# EAGLE design GO-RGO BOARD 26-09-22 final update 7PM (EAGLE 9.6.2)
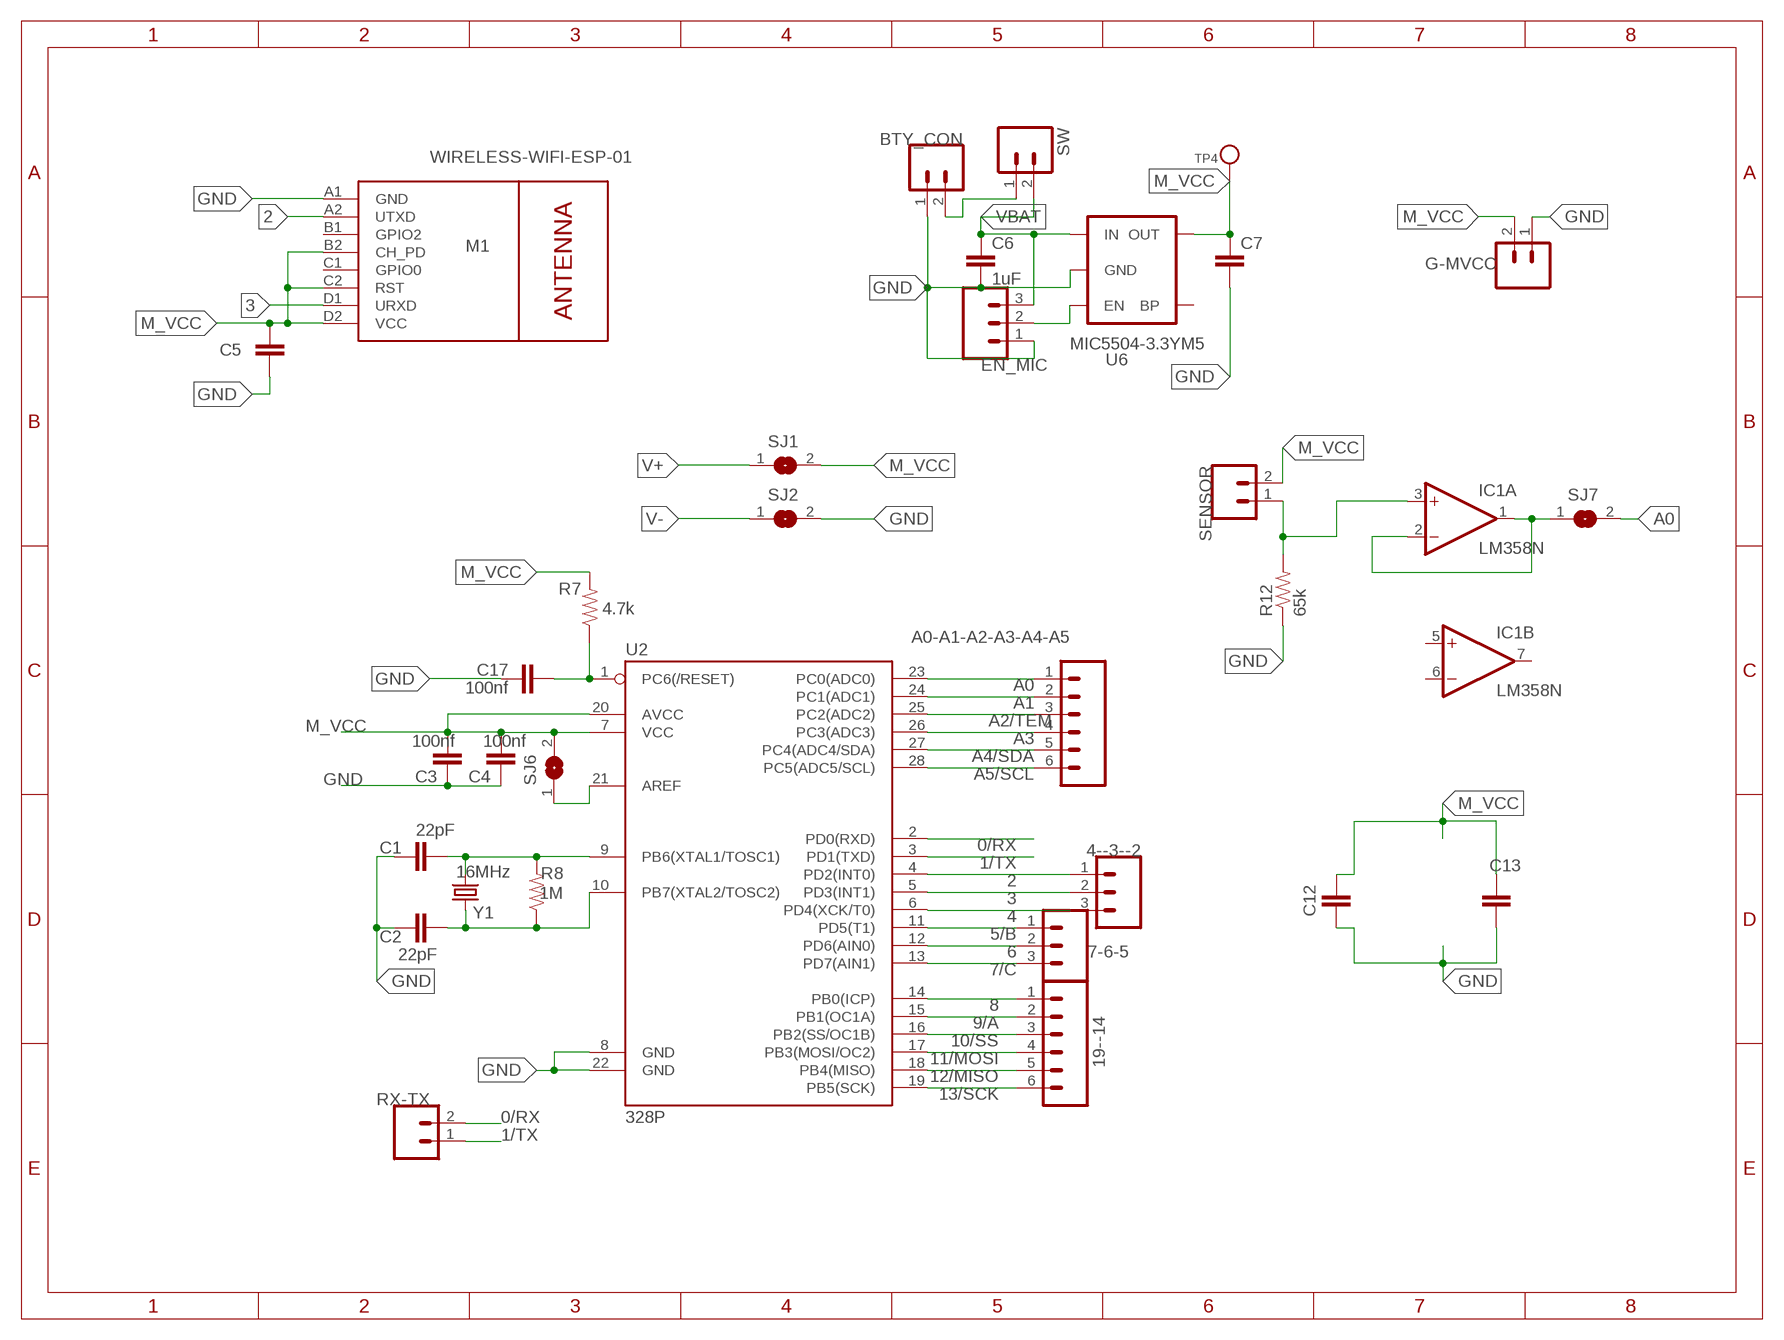
[diagram p0: schematic, sheet 1]

## Parts
4--3--2  M03PTH  [1X03]
7-6-5  M03PTH  [1X03]
19--14  M06SIP  [1X06]
A0-A1-A2-A3-A4-A5  M06SIP  [1X06]
BTY_CON  M02PTH  [1X02]
C1  22pF  CAP0805  [0805]
C2  22pF  CAP0805  [0805]
C3  100nf  CAP0805  [0805]
C4  100nf  CAP0805  [0805]
C5  100nf  CAP0805  [0805]
C6  1uF  CAP0805  [0805]
C7  1uF  CAP0805  [0805]
C12  100nf  CAP0805  [0805]
C13  100nf  CAP0805  [0805]
C17  100nf  CAP0805  [0805]
EN_MIC  M03PTH  [1X03]
G-MVCC  M02PTH  [1X02]
IC1  LM358N  [DIL08]
M1  WIRELESS-WIFI-ESP-01  [WIRELESS-WIFI-ESP-01]
R7  4.7k  RESISTOR0805-RES  [0805]
R8  1M  RESISTOR0805-RES  [0805]
R12  65k  RESISTOR0805-RES  [0805]
RX-TX  M02PTH  [1X02]
SENSOR  M02PTH  [1X02]
SJ1  SJ  [SJ]
SJ2  SJ  [SJ]
SJ6  SJ  [SJ]
SJ7  SJ  [SJ]
SW  M02PTH  [1X02]
TP4  TESTPOINTROUND1MM  [TESTPOINT_ROUND_1MM]
U2  328P  ATMEGA328P_PDIP  [DIP28]
U6  MIC5504-3.3YM5  V_REG_LDOSMD  [SOT23-5]
Y1  16MHz  CRYSTAL-16MHZPTH-HC49US  [HC49US]

## Nets
0/RX: RX-TX.2 U2.2(PD0(RXD))
1/TX: RX-TX.1 U2.3(PD1(TXD))
2: 4--3--2.1 M1.A2(UTXD) U2.4(PD2(INT0))
3: 4--3--2.2 M1.D1(URXD) U2.5(PD3(INT1))
4: 4--3--2.3 U2.6(PD4(XCK/T0))
5/B: 7-6-5.1 U2.11(PD5(T1))
6: 7-6-5.2 U2.12(PD6(AIN0))
7/C: 7-6-5.3 U2.13(PD7(AIN1))
8: 19--14.1 U2.14(PB0(ICP))
9/A: 19--14.2 U2.15(PB1(OC1A))
10/SS: 19--14.3 U2.16(PB2(SS/OC1B))
11/MOSI: 19--14.4 U2.17(PB3(MOSI/OC2))
12/MISO: 19--14.5 U2.18(PB4(MISO))
13/SCK: 19--14.6 U2.19(PB5(SCK))
A0: A0-A1-A2-A3-A4-A5.1 SJ7.2 U2.23(PC0(ADC0))
A1: A0-A1-A2-A3-A4-A5.2 U2.24(PC1(ADC1))
A2/TEM: A0-A1-A2-A3-A4-A5.3 U2.25(PC2(ADC2))
A3: A0-A1-A2-A3-A4-A5.4 U2.26(PC3(ADC3))
A4/SDA: A0-A1-A2-A3-A4-A5.5 U2.27(PC4(ADC4/SDA))
A5/SCL: A0-A1-A2-A3-A4-A5.6 U2.28(PC5(ADC5/SCL))
GND: BTY_CON.1 C1.1 C2.1 C3.1 C4.1 C5.1 C6.2 C7.2 C12.1 C13.1 C17.1 EN_MIC.1 G-MVCC.1 M1.A1(GND) R12.1 SJ2.2 U2.8(GND) U2.22(GND) U6.2(GND)
M_VCC: C3.2 C4.2 C5.2 C7.1 C12.2 C13.2 G-MVCC.2 M1.B2(CH_PD) M1.C2(RST) M1.D2(VCC) R7.2 SENSOR.2 SJ1.2 SJ6.2 TP4.P$1 U2.7(VCC) U2.20(AVCC) U6.5(OUT)
N$1: BTY_CON.2 SW.1
N$2: IC1.3(A:+IN) R12.2 SENSOR.1
N$9: EN_MIC.2 U6.3(EN)
N$12: C17.2 R7.1 U2.1(PC6(/RESET))
N$14: SJ6.1 U2.21(AREF)
N$19: IC1.1(A:OUT) IC1.2(A:-IN) SJ7.1
N$28: C1.2 R8.2 U2.9(PB6(XTAL1/TOSC1)) Y1.2
N$29: C2.2 R8.1 U2.10(PB7(XTAL2/TOSC2)) Y1.1
V+: SJ1.1
V-: SJ2.1
VBAT: C6.1 EN_MIC.3 SW.2 U6.1(IN)
Unconnected: IC1.5(B:+IN) IC1.6(B:-IN) IC1.7(B:OUT) M1.B1(GPIO2) M1.C1(GPIO0) U6.4(BP)

## Power pins joined to a net without a drawn wire
V+: IC1.8(P:V+)
V-: IC1.4(P:V-)

## Library data of the parts
4--3--2 = SparkFun:M03: Header 3 Standard 3-pin 0.1" header. Use with straight break away headers (SKU : PRT-00116), right angle break away headers (PRT-00553), swiss pins (PRT-00743), machine pins (PRT-00117), and female headers (PRT-00115). Molex polarized connector foot print use with SKU : PRT-08232 with associated crimp pins and housings.
7-6-5 = SparkFun-Connectors1:M03: Header 3 Standard 3-pin 0.1" header. Use with straight break away headers (SKU : PRT-00116), right angle break away headers (PRT-00553), swiss pins (PRT-00743), machine pins (PRT-00117), and female headers (PRT-00115). Molex polarized connector foot print use with SKU : PRT-08232 with associated crimp pins and housings.
19--14 A0-A1-A2-A3-A4-A5 = SparkFun:M06: Header 6 Standard 6-pin 0.1" header. Use with straight break away headers (SKU : PRT-00116), right angle break away headers (PRT-00553), swiss pins (PRT-00743), machine pins (PRT-00117), and female headers (PRT-00115). Molex polarized connector foot print use with SKU : PRT-08094 with associated crimp pins and housings. NOTES ON THE VARIANTS LOCK and LOCK_LONGPADS... This footprint was designed to help hold the alignment of a through-hole component (i.e. 6-pin header) while soldering it into place. You may notice that each hole has been shifted either up or down by 0.005 of an inch from it's more standard position (which is a perfectly straight line). This slight alteration caused the pins (the squares in the middle) to touch the edges of the holes. Because they are alternating, it causes a "brace" to hold the component in place. 0.005 has proven to be the perfect amount of "off-center" position when using our standard breakaway headers. Although looks a little odd when you look at the bare footprint, once you have a header in there, the alteration is very hard to notice. Also, if you push a header all the way into place, it is covered up entirely on the bottom side. This idea of altering the position of holes to aid alignment will be further integrated into the Sparkfun Library for other footprints. It can help hold any component with 3 or more connection pins.
BTY_CON G-MVCC RX-TX SENSOR = SparkFun-3-2-07:M02: Header 2
C1-C5 C17 = SparkFun-Capacitors:CAP: Capacitor Standard 0603 ceramic capacitor, and 0.1" leaded capacitor.
C6 C7 C12 C13 = SparkFun-Passives1:CAP: Capacitor Standard 0603 ceramic capacitor, and 0.1" leaded capacitor.
EN_MIC = SparkFun-3-2-07:M03: Header 3 Standard 3-pin 0.1" header. Use with straight break away headers (SKU : PType-HD), right angle break away headers (PType-HD-RightAngle), swiss pins (PType-30F), machine pins (PType-MP), and female headers (PType-FH). Molex polarized connector foot print use with SKU : Con-Hdr with associated crimp pins and housings.
IC1 = linear:LM358: OP AMP also LM158; LM258; LM2904 Source: http://cache.national.com/ds/LM/LM158.pdf
M1 = diy-modules:WIRELESS-WIFI-ESP-01: Wireless Wi-Fi ESP-01 Module based on ESP8266 chip Click here to find device on ebay.com <http://www.ebay.com/sch/esp8266+esp+01+transceiver>
R7 R8 R12 = SparkFun-Passives:RESISTOR: Resistor Basic schematic elements and footprints for 0603, 1206, and PTH resistors.
SJ1 SJ2 SJ6 SJ7 = jumper:SJ: SMD solder JUMPER
SW = SparkFun:M02: Header 2
TP4 = microbuilder:TESTPOINT: Test Point Various test points for characterisation and PCB testing TESTPOINT_SMT - Compact Surface Mount Test Point [Digikey: 5016KTR-ND]
U2 = SparkFun-IC-Microcontroller:ATMEGA328P_PDIP: Atmel 328P Through hole ATMEGA328P uC used in the Arduino 32kb flash, 1k EEPROM, 2k SRAM Datasheet <http://www.sparkfun.com/datasheets/Components/SMD/ATMega328.pdf> SparkFun Products Storefront component: AVR 28 Pin 20MHz 32K 6A/D - ATMega328P <https://www.sparkfun.com/products/9061> (COM-09061) SparkFun Simon Says - Through-Hole Soldering Kit <https://www.sparkfun.com/products/10547> (KIT-10547) SparkFun Learn to Solder - Simon Says <https://www.sparkfun.com/products/13708> (KIT-13708) SparkFun BigTime Watch Kit <https://www.sparkfun.com/products/11734> (KIT-11734) SparkFun ClockIt <https://www.sparkfun.com/products/10930> (KIT-10930) SparkFun Serial Enabled LCD Kit <https://www.sparkfun.com/products/10097> (LCD-10097) SparkFun Simon Tilts - Through Hole Soldering Kit <https://www.sparkfun.com/products/12634> (KIT-12634) SparkFun Frequency Counter Kit <https://www.sparkfun.com/products/10140> (KIT-10140) FabFM Radio Kit <https://www.sparkfun.com/products/11043> (KIT-11043) SparkFun Binary Blaster Kit <https://www.sparkfun.com/products/12037> (KIT-12037) SparkFun Metro-Gnome <https://www.sparkfun.com/products/9236> (KIT-09236) ATmega328 with Arduino Optiboot (Uno) <https://www.sparkfun.com/products/10524> (DEV-10524); PROD_ID: IC-09136
U6 = SparkFun:V_REG_LDO: Voltage Regulator LDO Standard 150mA LDO voltage regulator in SOT-23 layout. Micrel part MIC5205. BP (by-pass) pin is used to lower output noise with 470pF cap.
Y1 = SparkFun-Clocks:CRYSTAL-16MHZ: 16MHz Crystal Digikey Example <http://www.digikey.com/product-search/en?keywords=535-9122-1-ND> Frequency: 16MHz Frequency Stability: ±50ppm Frequency Tolerance: ±20ppm Load Capacitance: 18pF SparkFun Products: Pro Micro -5V/16MHz <https://www.sparkfun.com/products/12640> SparkFun Serial Enabled LCD Kit <https://www.sparkfun.com/products/10097>; PROD_ID: XTAL-08181; SF_ID: COM-00536

## Board
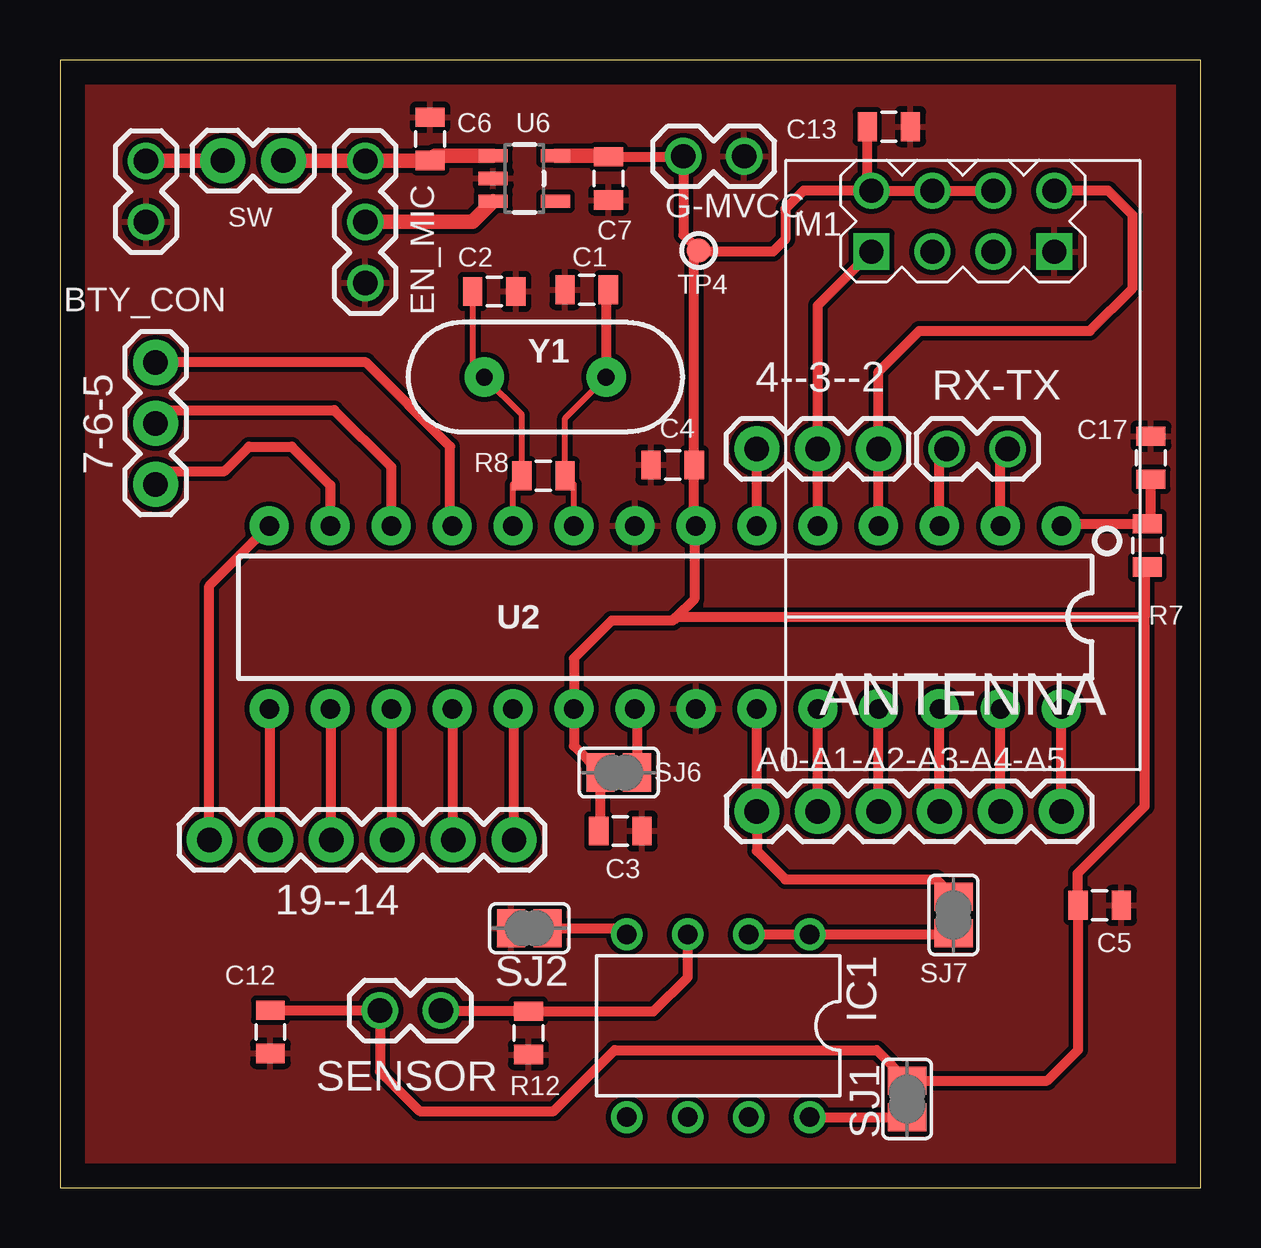
[diagram p1: board, top side]
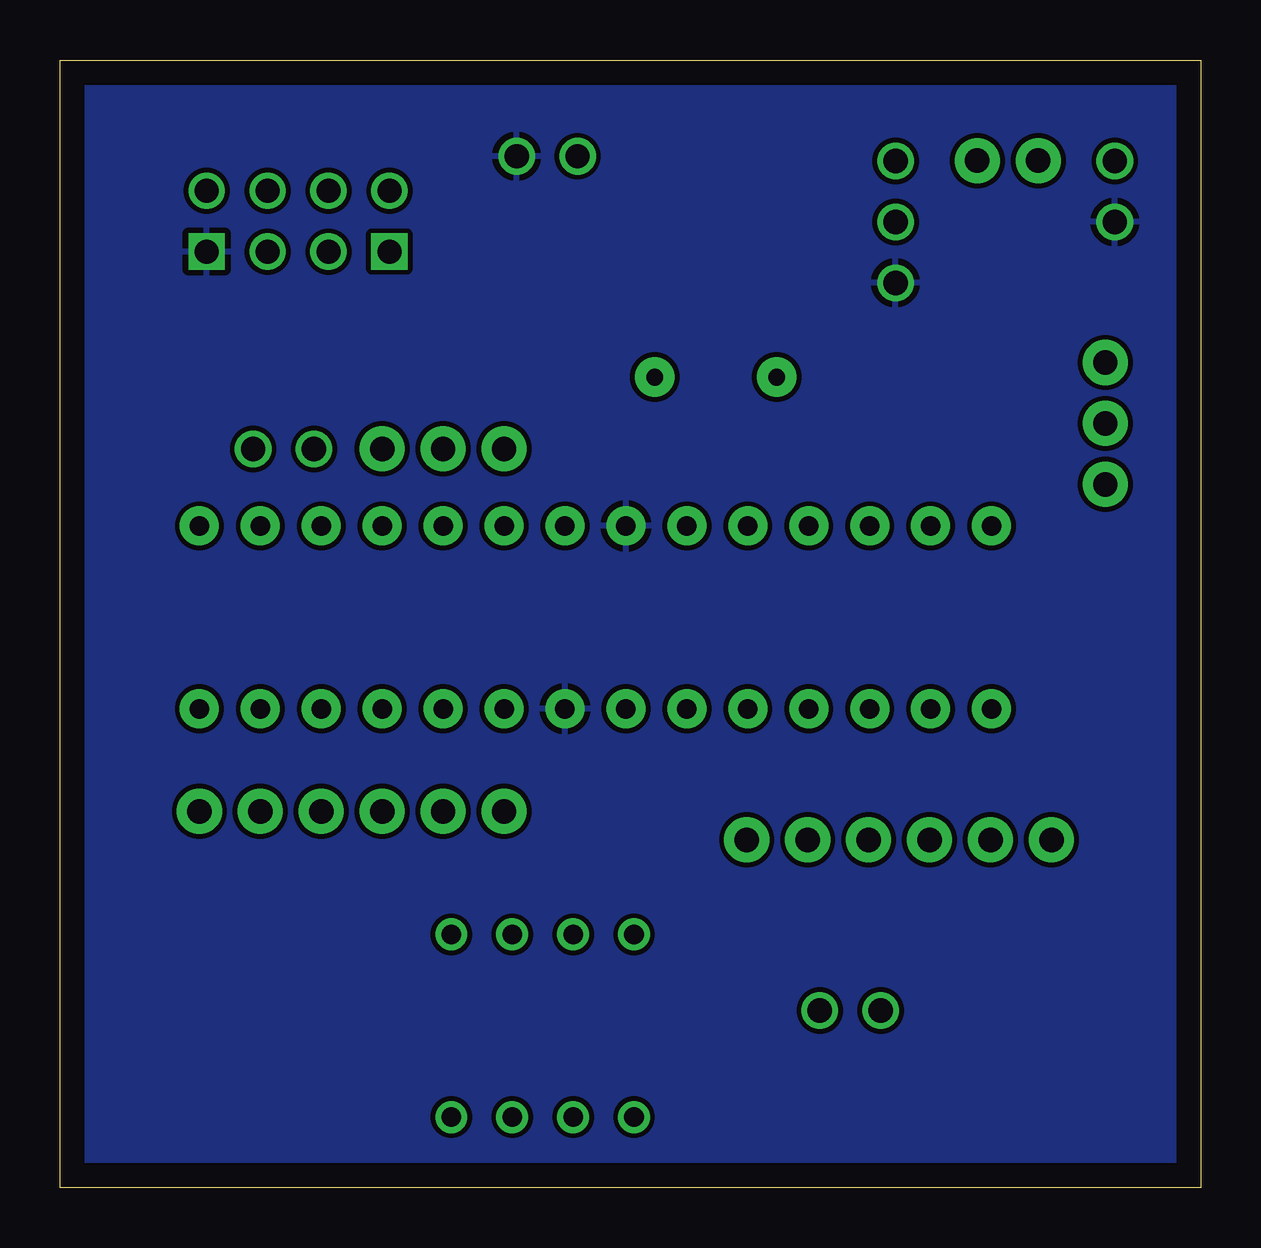
[diagram p2: board, bottom side, seen from below]

Size 47.56 x 46.99 mm. Coordinates in mm from the lower left corner, seen from the top.
Outline: 0,0 47.56,0 47.56,46.99 0,46.99 0,0
Copper layers (1*16): Top 0.035mm / dielectric 1.5mm / Bottom 0.035mm
Design rules "default *": minimum track width 10mil, minimum drill 10mil, track to track 8mil, track to pad 8mil, pad to pad 8mil, via to via 8mil, smd to smd 8mil, copper to edge 40mil, drill to drill 8mil, minimum pad ring 10mil, minimum via ring 8mil, stop-mask expansion 4mil, vias tented up to drill 0mil, thermal gap 10mil

### Footprints (pad centres in the part's own frame; a part is rotated, then mirrored left to right if it is on the bottom)
1X03 = drill 1.016 pad 1.88: 1 0,0; 2 2.54,0; 3 5.08,0
1X06 = drill 1.016 pad 1.88: 1 0,0; 2 2.54,0; 3 5.08,0; 4 7.62,0; 5 10.16,0; 6 12.7,0
1X02 = drill 1.016: 1 0,0; 2 2.54,0
0805 = smd 0.8 x 1.2: 1 -0.9,0; 2 0.9,0
1X03' = drill 1.016: 1 0,0; 2 2.54,0; 3 5.08,0
DIL08 = drill 0.813 pad 1.27: 1 -3.81,-3.81; 2 -1.27,-3.81; 3 1.27,-3.81; 4 3.81,-3.81; 5 3.81,3.81; 6 1.27,3.81; 7 -1.27,3.81; 8 -3.81,3.81
WIRELESS-WIFI-ESP-01 = drill 1 square: A1 -8.89,3.81; D1 -8.89,-3.81 | drill 1: A2 -11.43,3.81; B1 -8.89,1.27; B2 -11.43,1.27; C1 -8.89,-1.27; C2 -11.43,-1.27; D2 -11.43,-3.81
SJ = smd 1.168 x 1.6: 1 -0.762,0; 2 0.762,0
1X02' = drill 1.016 pad 1.88: 1 0,0; 2 2.54,0
TESTPOINT_ROUND_1MM = smd 1 x 1: P$1 0,0
DIP28 = drill 0.813 pad 1.626: 1 -16.51,-3.81; 2 -13.97,-3.81; 3 -11.43,-3.81; 4 -8.89,-3.81; 5 -6.35,-3.81; 6 -3.81,-3.81; 7 -1.27,-3.81; 8 1.27,-3.81; 9 3.81,-3.81; 10 6.35,-3.81; 11 8.89,-3.81; 12 11.43,-3.81; 13 13.97,-3.81; 14 16.51,-3.81; 15 16.51,3.81; 16 13.97,3.81; 17 11.43,3.81; 18 8.89,3.81; 19 6.35,3.81; 20 3.81,3.81; 21 1.27,3.81; 22 -1.27,3.81; 23 -3.81,3.81; 24 -6.35,3.81; 25 -8.89,3.81; 26 -11.43,3.81; 27 -13.97,3.81; 28 -16.51,3.81
SOT23-5 = smd 0.55 x 1.2: 1 -0.95,-1.3; 2 0,-1.3; 3 0.95,-1.3; 4 0.95,1.3; 5 -0.95,1.3
HC49US = drill 0.7 pad 1.651: 1 -2.54,0; 2 2.54,0

### Placement (x,y rotation side)
4--3--2  34.12,30.79 180 top
7-6-5  3.98,34.39 270 top
19--14  6.23,14.5 0 top
A0-A1-A2-A3-A4-A5  29.04,15.69 0 top
BTY_CON  3.59,40.24 90 top
C1  21.95,37.42 0 top
C2  18.1,37.35 180 top
C3  23.36,14.87 180 top
C4  25.53,30.12 0 top
C5  43.34,11.77 180 top
C6  15.43,43.7 90 top
C7  22.87,42.06 270 top
C12  8.77,6.5 90 top
C13  34.55,44.22 180 top
C17  45.47,30.42 270 top
EN_MIC  [1X03']  12.73,37.7 90 top
G-MVCC  28.52,42.98 180 top
IC1  27.44,6.75 180 top
M1  37.63,30.12 270 top
R7  45.33,26.77 270 top
R8  20.15,29.67 0 top
R12  19.53,6.45 90 top
RX-TX  36.96,30.79 0 top
SENSOR  15.88,7.39 180 top
SJ1  35.31,3.7 90 top
SJ2  19.56,10.81 180 top
SJ6  23.29,17.3 180 top
SJ7  37.24,11.37 90 top
SW  [1X02']  6.78,42.8 0 top
TP4  26.63,39.05 0 top
U2  25.23,23.77 180 top
U6  19.36,42.06 270 top
Y1  20.22,33.78 0 top

### Tracks (layer width: path | path; a pad name or v marks a point on that pad's centre or on a via)
0/RX
  Top 0.406: U2.2 39.2,30.49 RX-TX.2
1/TX
  Top 0.406: U2.3 36.66,30.49 RX-TX.1
2
  Top 0.406: M1.A2 43.69,41.55 44.71,40.53 44.71,37.48 42.93,35.71 35.82,35.71 34.12,34.01 4--3--2.1 U2.4
3
  Top 0.406: M1.D1 31.58,36.77 4--3--2.2 U2.5
4
  Top 0.406: U2.6 4--3--2.3
5/B
  Top 0.406: U2.11 16.26,27.66 16.26,30.88 12.75,34.39 7-6-5.1
6
  Top 0.406: 7-6-5.2 4.54,32.4 11.44,32.4 13.8,30.04 U2.12
7/C
  Top 0.406: 7-6-5.3 4.54,29.86 6.86,29.86 7.88,30.88 9.66,30.88 11.26,29.27 U2.13
8
  Top 0.406: 19--14.1 6.23,25.08 U2.14
9/A
  Top 0.406: 19--14.2 8.77,19.91 U2.15
10/SS
  Top 0.406: 19--14.3 11.31,19.91 U2.16
11/MOSI
  Top 0.406: 19--14.4 13.85,19.91 U2.17
12/MISO
  Top 0.406: 19--14.5 16.39,19.91 U2.18
13/SCK
  Top 0.406: 19--14.6 18.93,19.91 U2.19
A0
  Top 0.406: U2.23 A0-A1-A2-A3-A4-A5.1 29.04,14.03 30.23,12.85 36.52,12.85 SJ7.2
A1
  Top 0.406: A0-A1-A2-A3-A4-A5.2 U2.24
A2/TEM
  Top 0.406: A0-A1-A2-A3-A4-A5.3 U2.25
A3
  Top 0.406: A0-A1-A2-A3-A4-A5.4 U2.26
A4/SDA
  Top 0.406: A0-A1-A2-A3-A4-A5.5 U2.27
A5/SCL
  Top 0.406: A0-A1-A2-A3-A4-A5.6 U2.28
GND
  pour Top: -20.57,51.07 -21.58,-6.71 68.21,-6.8 68.48,50.61
  pour Bottom: -23.99,54.49 -25.61,-5.21 67.18,-5.19 67.45,54.41
M_VCC
  Top 0.406: 25.68,23.77 26.44,24.53 26.44,27.52 U2.7 26.43,27.65 C4.2 26.43,38.86 TP4.P$1 | 25.68,23.77 25.54,23.63 22.99,23.63 21.42,22.06 U2.20 21.42,18.41 SJ6.2 22.53,14.94 C3.2 | M1.D2 M1.C2 M1.B2 | C7.1 25.98,42.95 G-MVCC.2 25.98,39.71 TP4.P$1 | M1.D2 30.99,41.55 30.23,40.79 30.23,39.52 29.72,39.01 26.68,39.01 TP4.P$1 | 45.22,23.77 25.68,23.77 | M1.D2 33.65,41.72 C13.2 | 45.22,23.77 45.22,15.89 42.42,13.1 42.42,11.78 C5.2 42.44,5.75 41.15,4.46 SJ1.2 34.04,5.73 23.12,5.73 20.58,3.19 14.99,3.19 13.34,4.85 SENSOR.2 | SENSOR.2 13.32,7.41 | R7.2 45.22,25.76 45.22,23.77 | SENSOR.2 8.78,7.39 C12.2
  Top 0.61: U6.5 22.82,43.01 C7.1
N$1
  Top 0.61: BTY_CON.2 6.77,42.78 SW.1
N$2
  Top 0.406: IC1.3 26.17,8.78 24.74,7.35 R12.2 19.49,7.39 SENSOR.1
N$9
  Top 0.61: EN_MIC.2 17.2,40.25 U6.3
N$12
  Top 0.406: U2.1 41.83,27.67 R7.1 45.47,27.81 C17.2
N$14
  Top 0.406: U2.21 24.06,19.87 SJ6.1
N$19
  Top 0.406: IC1.2 IC1.1 37.2,10.56 SJ7.1
N$28
  Top 0.254: U2.9 21.42,29.3 R8.2 21.05,32.07 Y1.2
  Top 0.406: C1.2 22.76,37.33 Y1.2
N$29
  Top 0.254: U2.10 18.88,29.3 R8.1 19.25,32.21 Y1.1 17.2,34.26 C2.2
V+
  Top 0.406: IC1.8 SJ1.1
V-
  Top 0.406: SJ2.1 23.37,10.81 IC1.4
VBAT
  Top 0.61: SW.2 EN_MIC.3 15.41,42.78 C6.1 15.63,43.01 U6.1